# EAGLE schematic clock (EAGLE 9.5.2)
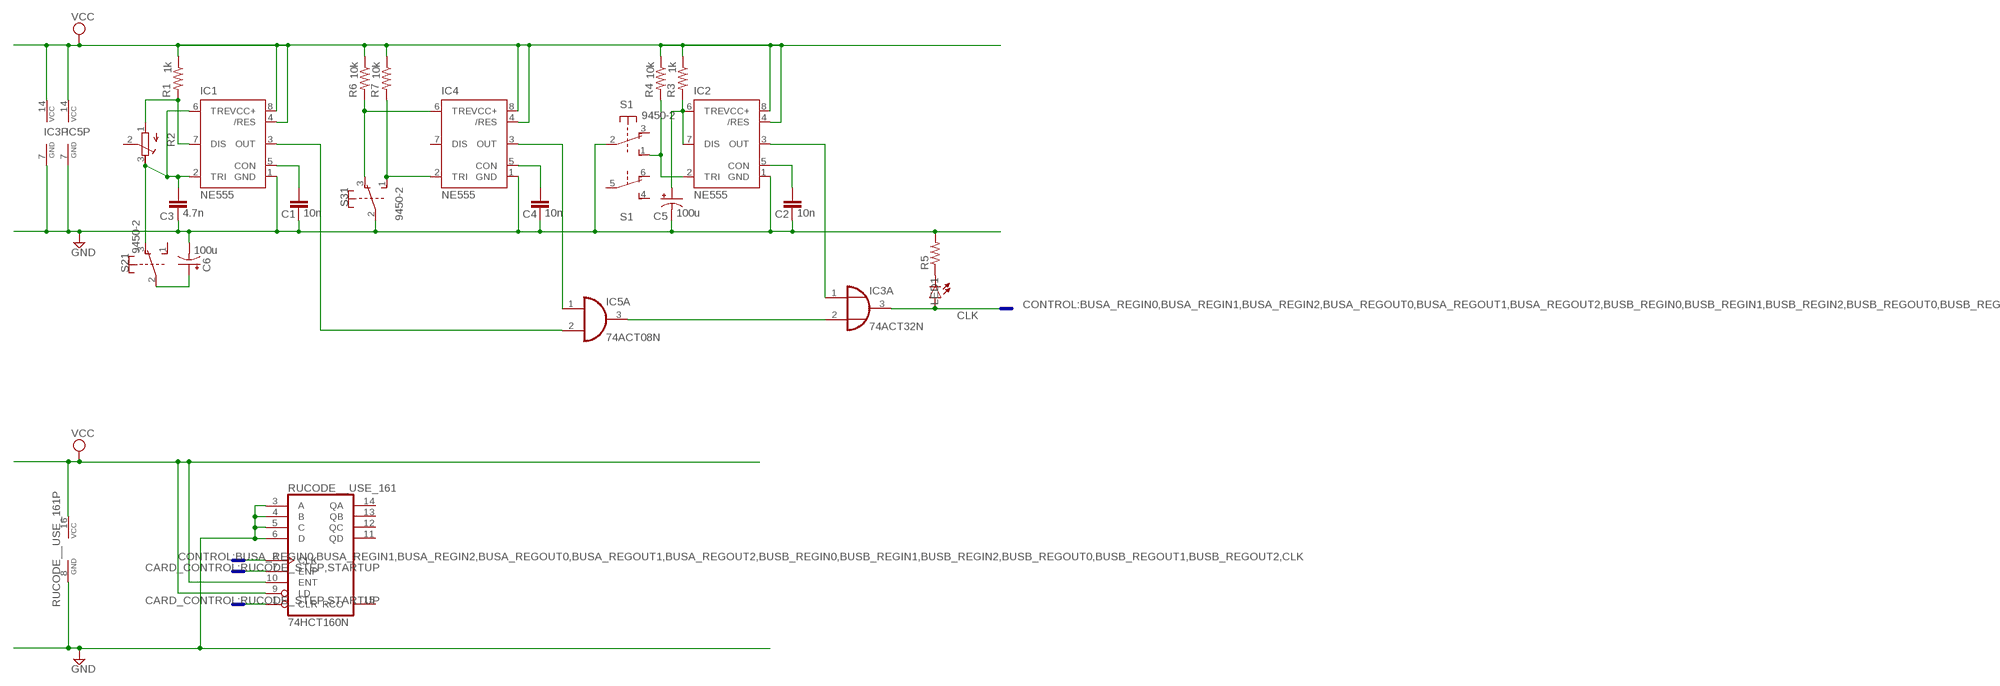
[diagram p0: schematic, sheet 1, part 1 of 2]
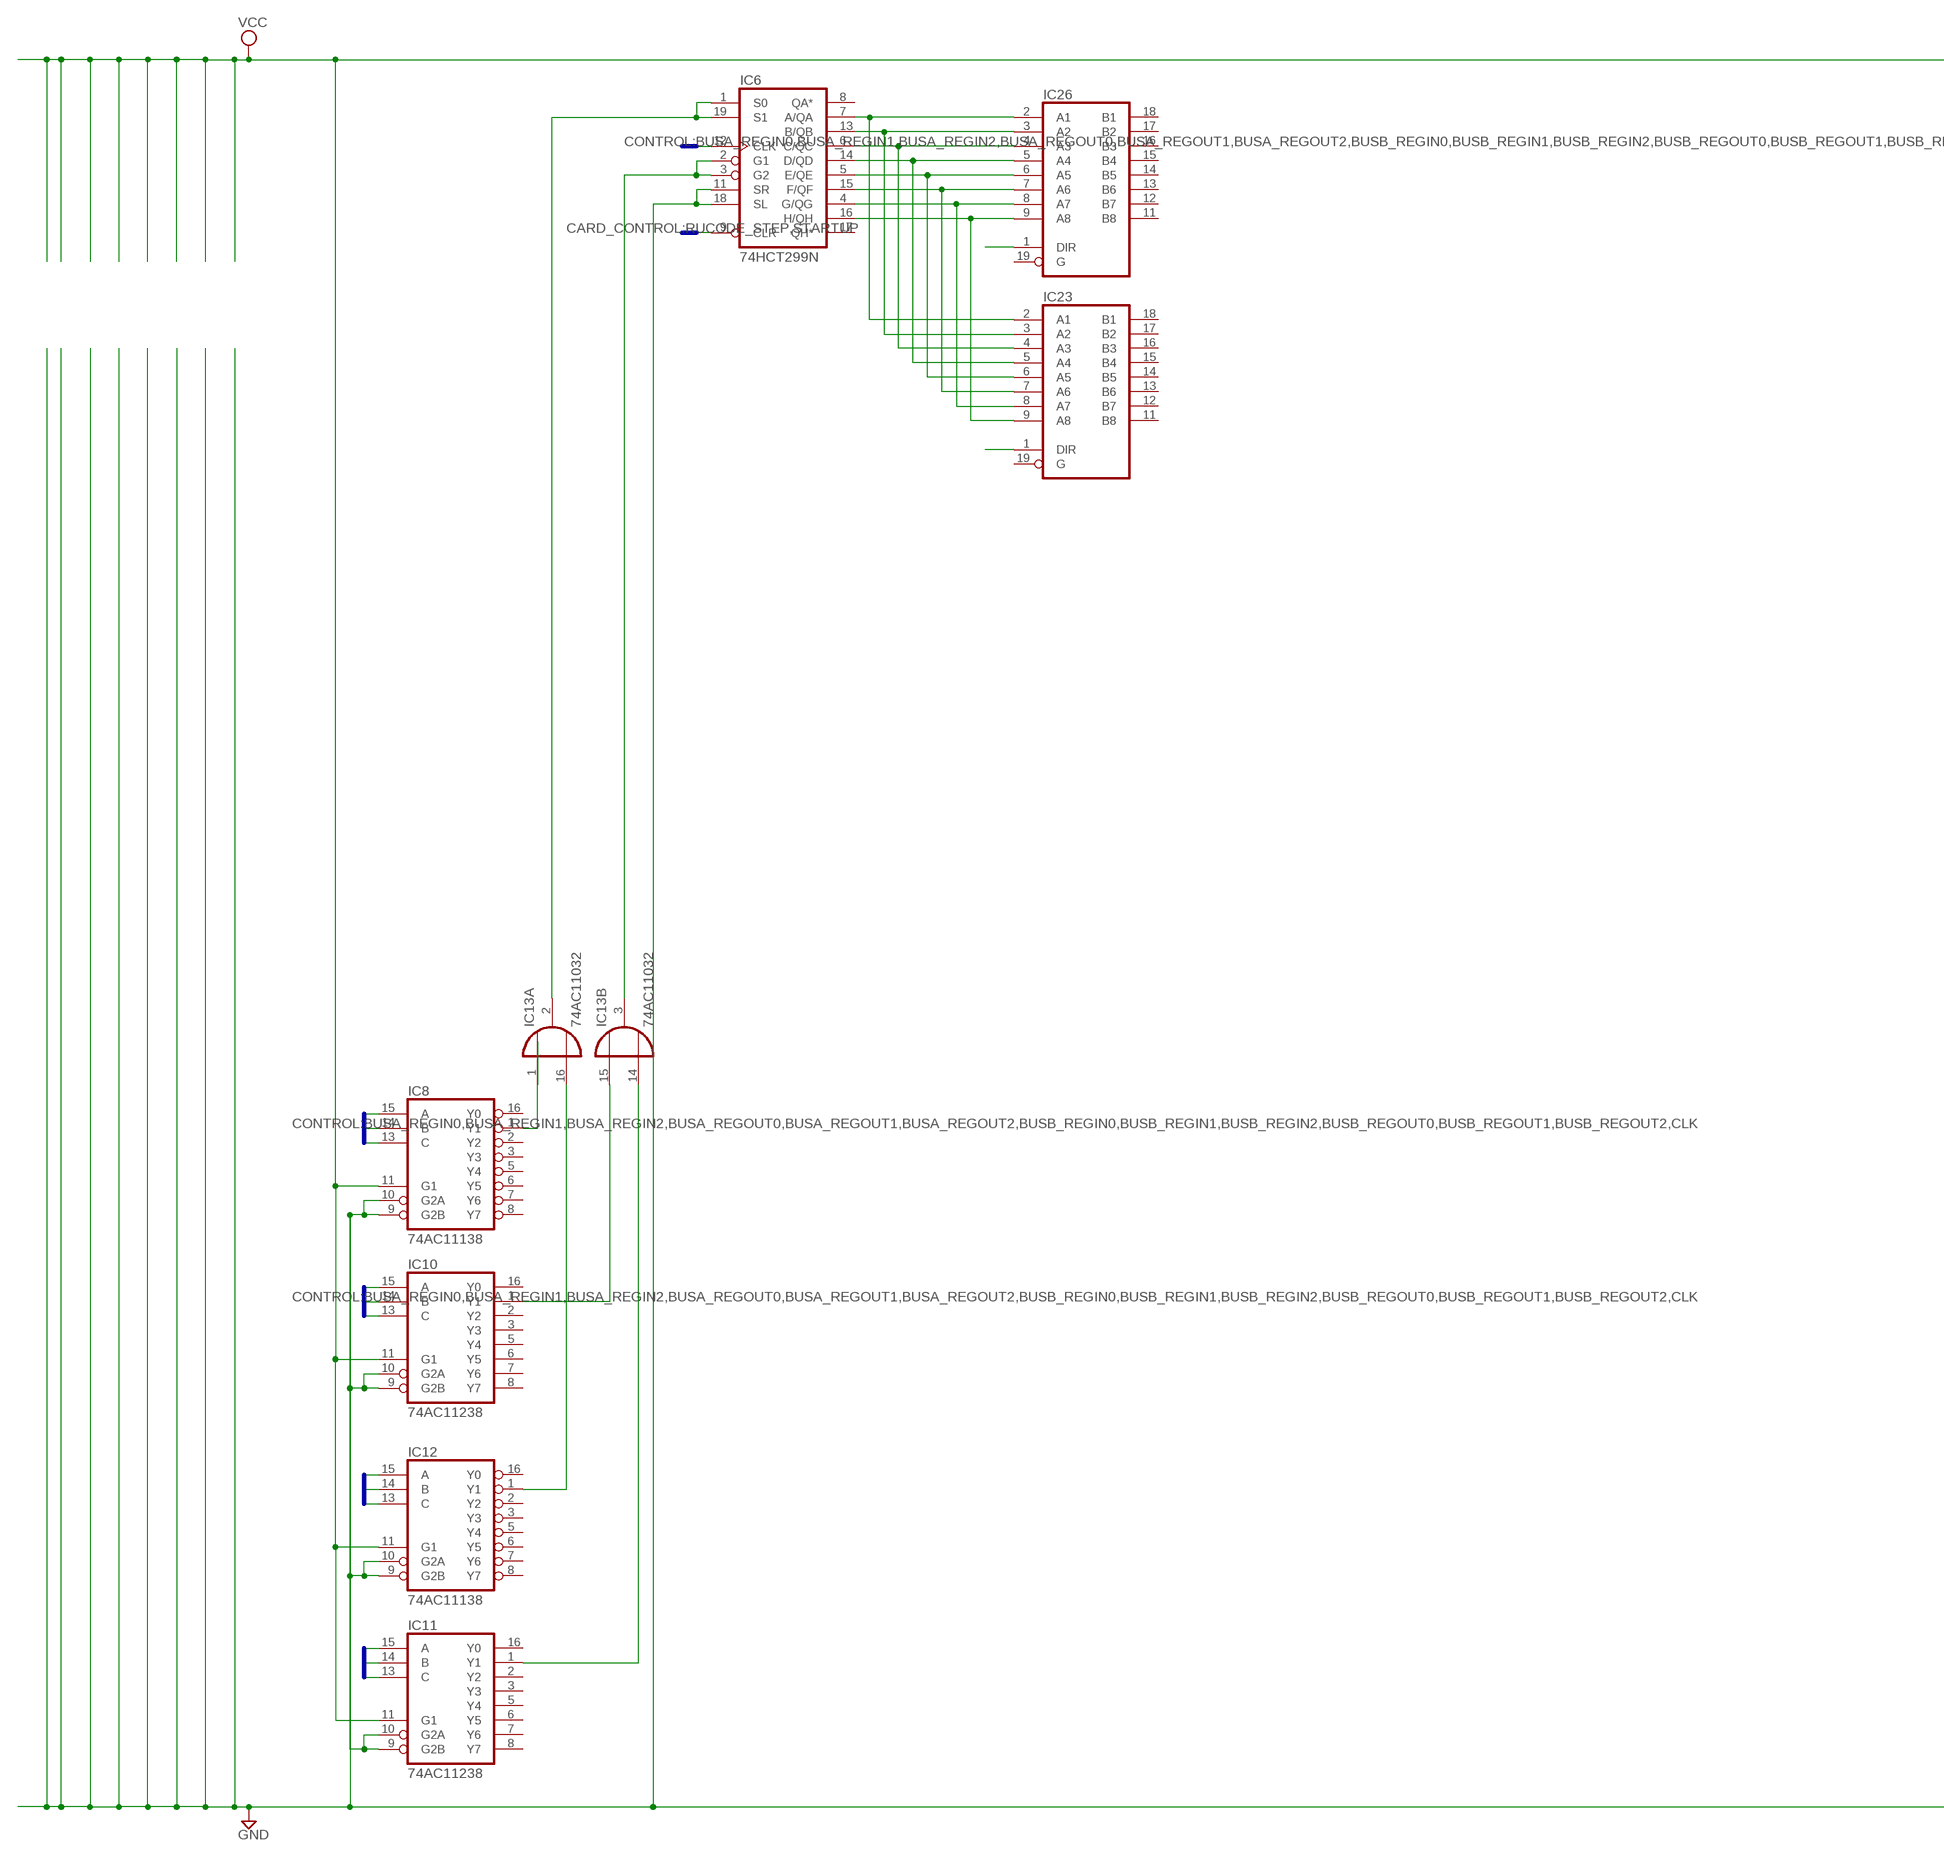
[diagram p1: schematic, sheet 1, part 2 of 2]

## Parts
C1  10n  C-EU050-024X044  [C050-024X044]
C2  10n  C-EU050-024X044  [C050-024X044]
C3  4.7n  C-EU050-024X044  [C050-024X044]
C4  10n  C-EU050-024X044  [C050-024X044]
C5  100u  CPOL-USE3.5-8  [E3,5-8]
C6  100u  CPOL-USE3.5-8  [E3,5-8]
IC1  NE555  [DIL-08]
IC2  NE555  [DIL-08]
IC3  74ACT32N  [DIL14]
IC4  NE555  [DIL-08]
IC5  74ACT08N  [DIL14]
IC6  74HCT299N  [DIL20]
IC8  74AC11138  [DIL16]
IC10  74AC11238  [DIL16]
IC11  74AC11238  [DIL16]
IC12  74AC11138  [DIL16]
IC13  74AC11032  [DIL16]
IC23  74HC245N  [DIL20]
IC26  74HC245N  [DIL20]
LED1  LED5MM  [LED5MM]
R1  1k  R-US_0207/10  [0207/10]
R2  R-TRIMM64X  [RTRIM64X]
R3  1k  R-US_0207/10  [0207/10]
R4  10k  R-US_0207/10  [0207/10]
R5  R-US_0207/10  [0207/10]
R6  10k  R-US_0207/10  [0207/10]
R7  10k  R-US_0207/10  [0207/10]
RUCODE__USE_161  74HCT160N  [DIL16]
S1  9450-2  [9450-2]
S2  9450-2  [9450-2]
S3  9450-2  [9450-2]

## Nets
BUSA_REGIN0: IC8.15(A)
BUSA_REGIN1: IC8.14(B)
BUSA_REGIN2: IC8.13(C)
BUSA_REGOUT0: IC10.15(A)
BUSA_REGOUT1: IC10.14(B)
BUSA_REGOUT2: IC10.13(C)
BUSB_REGIN0: IC12.15(A)
BUSB_REGIN1: IC12.14(B)
BUSB_REGIN2: IC12.13(C)
BUSB_REGOUT0: IC11.15(A)
BUSB_REGOUT1: IC11.14(B)
BUSB_REGOUT2: IC11.13(C)
CLK: IC3.3(A:O) IC6.12(CLK) LED1.A RUCODE__USE_161.2(CLK)
GND: C1.2 C2.2 C3.2 C4.2 C5.- C6.- IC1.1(GND) IC2.1(GND) IC3.7(P:GND) IC4.1(GND) IC5.7(P:GND) IC6.11(SR) IC6.18(SL) IC8.9(G2B) IC8.10(G2A) IC10.9(G2B) IC10.10(G2A) IC11.9(G2B) IC11.10(G2A) IC12.9(G2B) IC12.10(G2A) R5.2 RUCODE__USE_161.3(A) RUCODE__USE_161.4(B) RUCODE__USE_161.5(C) RUCODE__USE_161.6(D) RUCODE__USE_161.8(GND) S1.2(1:P) S3.2(1:P)
N$1: C3.1 IC1.2(TRI) IC1.6(TRE) R2.3(E) S2.3(1:O)
N$2: IC1.7(DIS) R1.2 R2.1(A)
N$3: C1.1 IC1.5(CON)
N$4: C5.+ IC2.6(TRE) IC2.7(DIS) R3.2
N$5: IC2.2(TRI) R4.2 S1.1(1:S)
N$6: C2.1 IC2.5(CON)
N$7: IC1.3(OUT) IC5.2(A:I1)
N$8: IC6.7(A/QA) IC23.2(A1) IC26.2(A1)
N$9: LED1.K(C) R5.1
N$10: IC8.1(Y1) IC13.1(A:I1)
N$11: IC3.2(A:I1) IC5.3(A:O)
N$12: IC4.3(OUT) IC5.1(A:I0)
N$13: C4.1 IC4.5(CON)
N$14: IC2.3(OUT) IC3.1(A:I0)
N$15: C6.+ S2.2(1:P)
N$16: IC4.2(TRI) R7.2 S3.1(1:S)
N$17: IC4.6(TRE) R6.2 S3.3(1:O)
N$18: IC6.13(B/QB) IC23.3(A2) IC26.3(A2)
N$19: IC23.1(DIR)
N$20: IC6.6(C/QC) IC23.4(A3) IC26.4(A3)
N$25: IC6.2(G1) IC6.3(G2) IC13.3(B:O)
N$26: IC6.14(D/QD) IC23.5(A4) IC26.5(A4)
N$27: IC6.5(E/QE) IC23.6(A5) IC26.6(A5)
N$32: IC11.1(Y1) IC13.14(B:I2)
N$33: IC12.1(Y1) IC13.16(A:I2)
N$34: IC10.1(Y1) IC13.15(B:I1)
N$41: IC6.15(F/QF) IC23.7(A6) IC26.7(A6)
N$42: IC6.1(S0) IC6.19(S1) IC13.2(A:O)
N$43: IC6.4(G/QG) IC23.8(A7) IC26.8(A7)
N$44: IC26.1(DIR)
N$47: IC6.16(H/QH) IC23.9(A8) IC26.9(A8)
RUCODE_STEP: RUCODE__USE_161.7(ENP)
STARTUP: IC6.9(CLR) RUCODE__USE_161.1(CLR)
VCC: IC1.4(/RES) IC1.8(VCC+) IC2.4(/RES) IC2.8(VCC+) IC3.14(P:VCC) IC4.4(/RES) IC4.8(VCC+) IC5.14(P:VCC) IC8.11(G1) IC10.11(G1) IC11.11(G1) IC12.11(G1) R1.1 R3.1 R4.1 R6.1 R7.1 RUCODE__USE_161.9(LD) RUCODE__USE_161.10(ENT) RUCODE__USE_161.16(VCC)
Unconnected: IC3.4(B:I0) IC3.5(B:I1) IC3.6(B:O) IC3.8(C:O) IC3.9(C:I0) IC3.10(C:I1) IC3.11(D:O) IC3.12(D:I0) IC3.13(D:I1) IC4.7(DIS) IC5.4(B:I0) IC5.5(B:I1) IC5.6(B:O) IC5.8(C:O) IC5.9(C:I0) IC5.10(C:I1) IC5.11(D:O) IC5.12(D:I0) IC5.13(D:I1) IC6.8(QA*) IC6.17(QH*) IC8.2(Y2) IC8.3(Y3) IC8.5(Y4) IC8.6(Y5) IC8.7(Y6) IC8.8(Y7) IC8.16(Y0) IC10.2(Y2) IC10.3(Y3) IC10.5(Y4) IC10.6(Y5) IC10.7(Y6) IC10.8(Y7) IC10.16(Y0) IC11.2(Y2) IC11.3(Y3) IC11.5(Y4) IC11.6(Y5) IC11.7(Y6) IC11.8(Y7) IC11.16(Y0) IC12.2(Y2) IC12.3(Y3) IC12.5(Y4) IC12.6(Y5) IC12.7(Y6) IC12.8(Y7) IC12.16(Y0) IC13.6(C:O) IC13.7(D:O) IC13.8(D:I2) IC13.9(D:I1) IC13.10(C:I2) IC13.11(C:I1) IC23.11(B8) IC23.12(B7) IC23.13(B6) IC23.14(B5) IC23.15(B4) IC23.16(B3) IC23.17(B2) IC23.18(B1) IC23.19(G) IC26.11(B8) IC26.12(B7) IC26.13(B6) IC26.14(B5) IC26.15(B4) IC26.16(B3) IC26.17(B2) IC26.18(B1) IC26.19(G) R2.2(S) RUCODE__USE_161.11(QD) RUCODE__USE_161.12(QC) RUCODE__USE_161.13(QB) RUCODE__USE_161.14(QA) RUCODE__USE_161.15(RCO) S1.3(1:O) S1.4(2:S) S1.5(2:P) S1.6(2:O) S2.1(1:S) S2.4(2:S) S2.5(2:P) S2.6(2:O) S3.4(2:S) S3.5(2:P) S3.6(2:O)

## Buses
CONTROL:BUSA_REGIN0,BUSA_REGIN1,BUSA_REGIN2,BUSA_REGOUT0,BUSA_REGOUT1,BUSA_REGOUT2,BUSB_REGIN0,BUSB_REGIN1,BUSB_REGIN2,BUSB_REGOUT0,BUSB_REGOUT1,BUSB_REGOUT2,CLK
CARD_CONTROL:RUCODE_STEP,STARTUP

## Power pins joined to a net without a drawn wire
GND: IC6.10(GND) IC8.4(GND) IC10.4(GND) IC11.4(GND) IC12.4(GND) IC13.4(P:GND) IC13.5(P:GND) IC23.10(GND) IC26.10(GND)
VCC: IC6.20(VCC) IC8.12(VCC) IC10.12(VCC) IC11.12(VCC) IC12.12(VCC) IC13.12(P:VCC) IC13.13(P:VCC) IC23.20(VCC) IC26.20(VCC)

## Library data of the parts
C1-C4 = rcl:C-EU: CAPACITOR, European symbol; SPICEPREFIX: C
C5 C6 = rcl:CPOL-US: POLARIZED CAPACITOR, American symbol; SPICEPREFIX: C
IC1 IC2 IC4 = st-microelectronics:NE555: General purpose bipolar Timer; MF: Arrow Electronics; MPN: NE555N; OC_FARNELL: 1467742; OC_NEWARK: 89K1486
IC3 = 74xx-eu:74*32: Quad 2-input OR gate
IC5 = 74xx-eu:74*08: Quad 2-input AND gate
IC6 = 74xx-eu:74*299: 8-bit universal SHIFT/STORAGE REGISTER
IC8 IC12 = 74ac-logic:74AC11138: 3 to 8 line DECODER/DEMULTIPLEXER
IC10 IC11 = 74ac-logic:74AC11238: 3 to 8 line DECODER/DEMULTIPLEXER
IC13 = 74ac-logic:74AC11032: Quadruple 2-input OR
IC23 IC26 = 74xx-eu:74*245: Octal BUS TRANSCEIVER, 3-state
LED1 = led:LED: LED OSRAM: - CHIPLED LG R971, LG N971, LY N971, LG Q971, LY Q971, LO R971, LY R971 LH N974, LH R974 LS Q976, LO Q976, LY Q976 LO Q996 - Hyper CHIPLED LW Q18S LB Q993, LB Q99A, LB R99A - SideLED LS A670, LO A670, LY A670, LG A670, LP A670 LB A673, LV A673, LT A673, LW A673 LH A674 LY A675 LS A676, LA A676, LO A676, LY A676, LW A676 LS A679, LY A679, LG A679 - Hyper Micro SIDELED® LS Y876, LA Y876, LO Y876, LY Y876 LT Y87S - SmartLED LW L88C, LW L88S LB L89C, LB L89S, LG L890 LS L89K, LO L89K, LY L89K LS L896, LA L896, LO L896, LY L896 - TOPLED LS T670, LO T670, LY T670, LG T670, LP T670 LSG T670, LSP T670, LSY T670, LOP T670, LYG T670 LG T671, LOG T671, LSG T671 LB T673, LV T673, LT T673, LW T673 LH T674 LS T676, LA T676, LO T676, LY T676, LB T676, LH T676, LSB T676, LW T676 LB T67C, LV T67C, LT T67C, LS T67K, LO T67K, LY T67K, LW E67C LS E67B, LA E67B, LO E67B, LY E67B, LB E67C, LV E67C, LT E67C LW T67C LS T679, LY T679, LG T679 LS T770, LO T770, LY T770, LG T770, LP T770 LB T773, LV T773, LT T773, LW T773 LH T774 LS E675, LA E675, LY E675, LS T675 LS T776, LA T776, LO T776, LY T776, LB T776 LHGB T686 LT T68C, LB T68C - Hyper Mini TOPLED® LB M676 - Mini TOPLED Santana® LG M470 LS M47K, LO M47K, LY M47K Source: http://www.osram.convergy.de LUXEON: - LUMILED® LXK2-PW12-R00, LXK2-PW12-S00, LXK2-PW14-U00, LXK2-PW14-V00 LXK2-PM12-R00, LXK2-PM12-S00, LXK2-PM14-U00 LXK2-PE12-Q00, LXK2-PE12-R00, LXK2-PE12-S00, LXK2-PE14-T00, LXK2-PE14-U00 LXK2-PB12-K00, LXK2-PB12-L00, LXK2-PB12-M00, LXK2-PB14-N00, LXK2-PB14-P00, LXK2-PB14-Q00 LXK2-PR12-L00, LXK2-PR12-M00, LXK2-PR14-Q00, LXK2-PR14-R00 LXK2-PD12-Q00, LXK2-PD12-R00, LXK2-PD12-S00 LXK2-PH12-R00, LXK2-PH12-S00 LXK2-PL12-P00, LXK2-PL12-Q00, LXK2-PL12-R00 Source: www.luxeon.com KINGBRIGHT: KA-3528ASYC Source: www.kingbright.com
R1 R3-R7 = rcl:R-US_: RESISTOR, American symbol; SPICEPREFIX: R
R2 = rcl:R-TRIMM: Trimm resistor; SPICEMODEL: X; SPICEPREFIXL: POT
RUCODE__USE_161 = 74xx-eu:74*160: Synchronous 4-bit COUNTER
S1-S3 = switch-misc:9450-2: MARQUARDT SWITCH